# EasyEDA schematic SCH_Imposter-Game_2026-03-29.json
TITLE: Sheet_1; REV: 1.0; Date: 2026-01-31; Sheet: 1/1; Drawn By: shaur1021; Company: Your Company
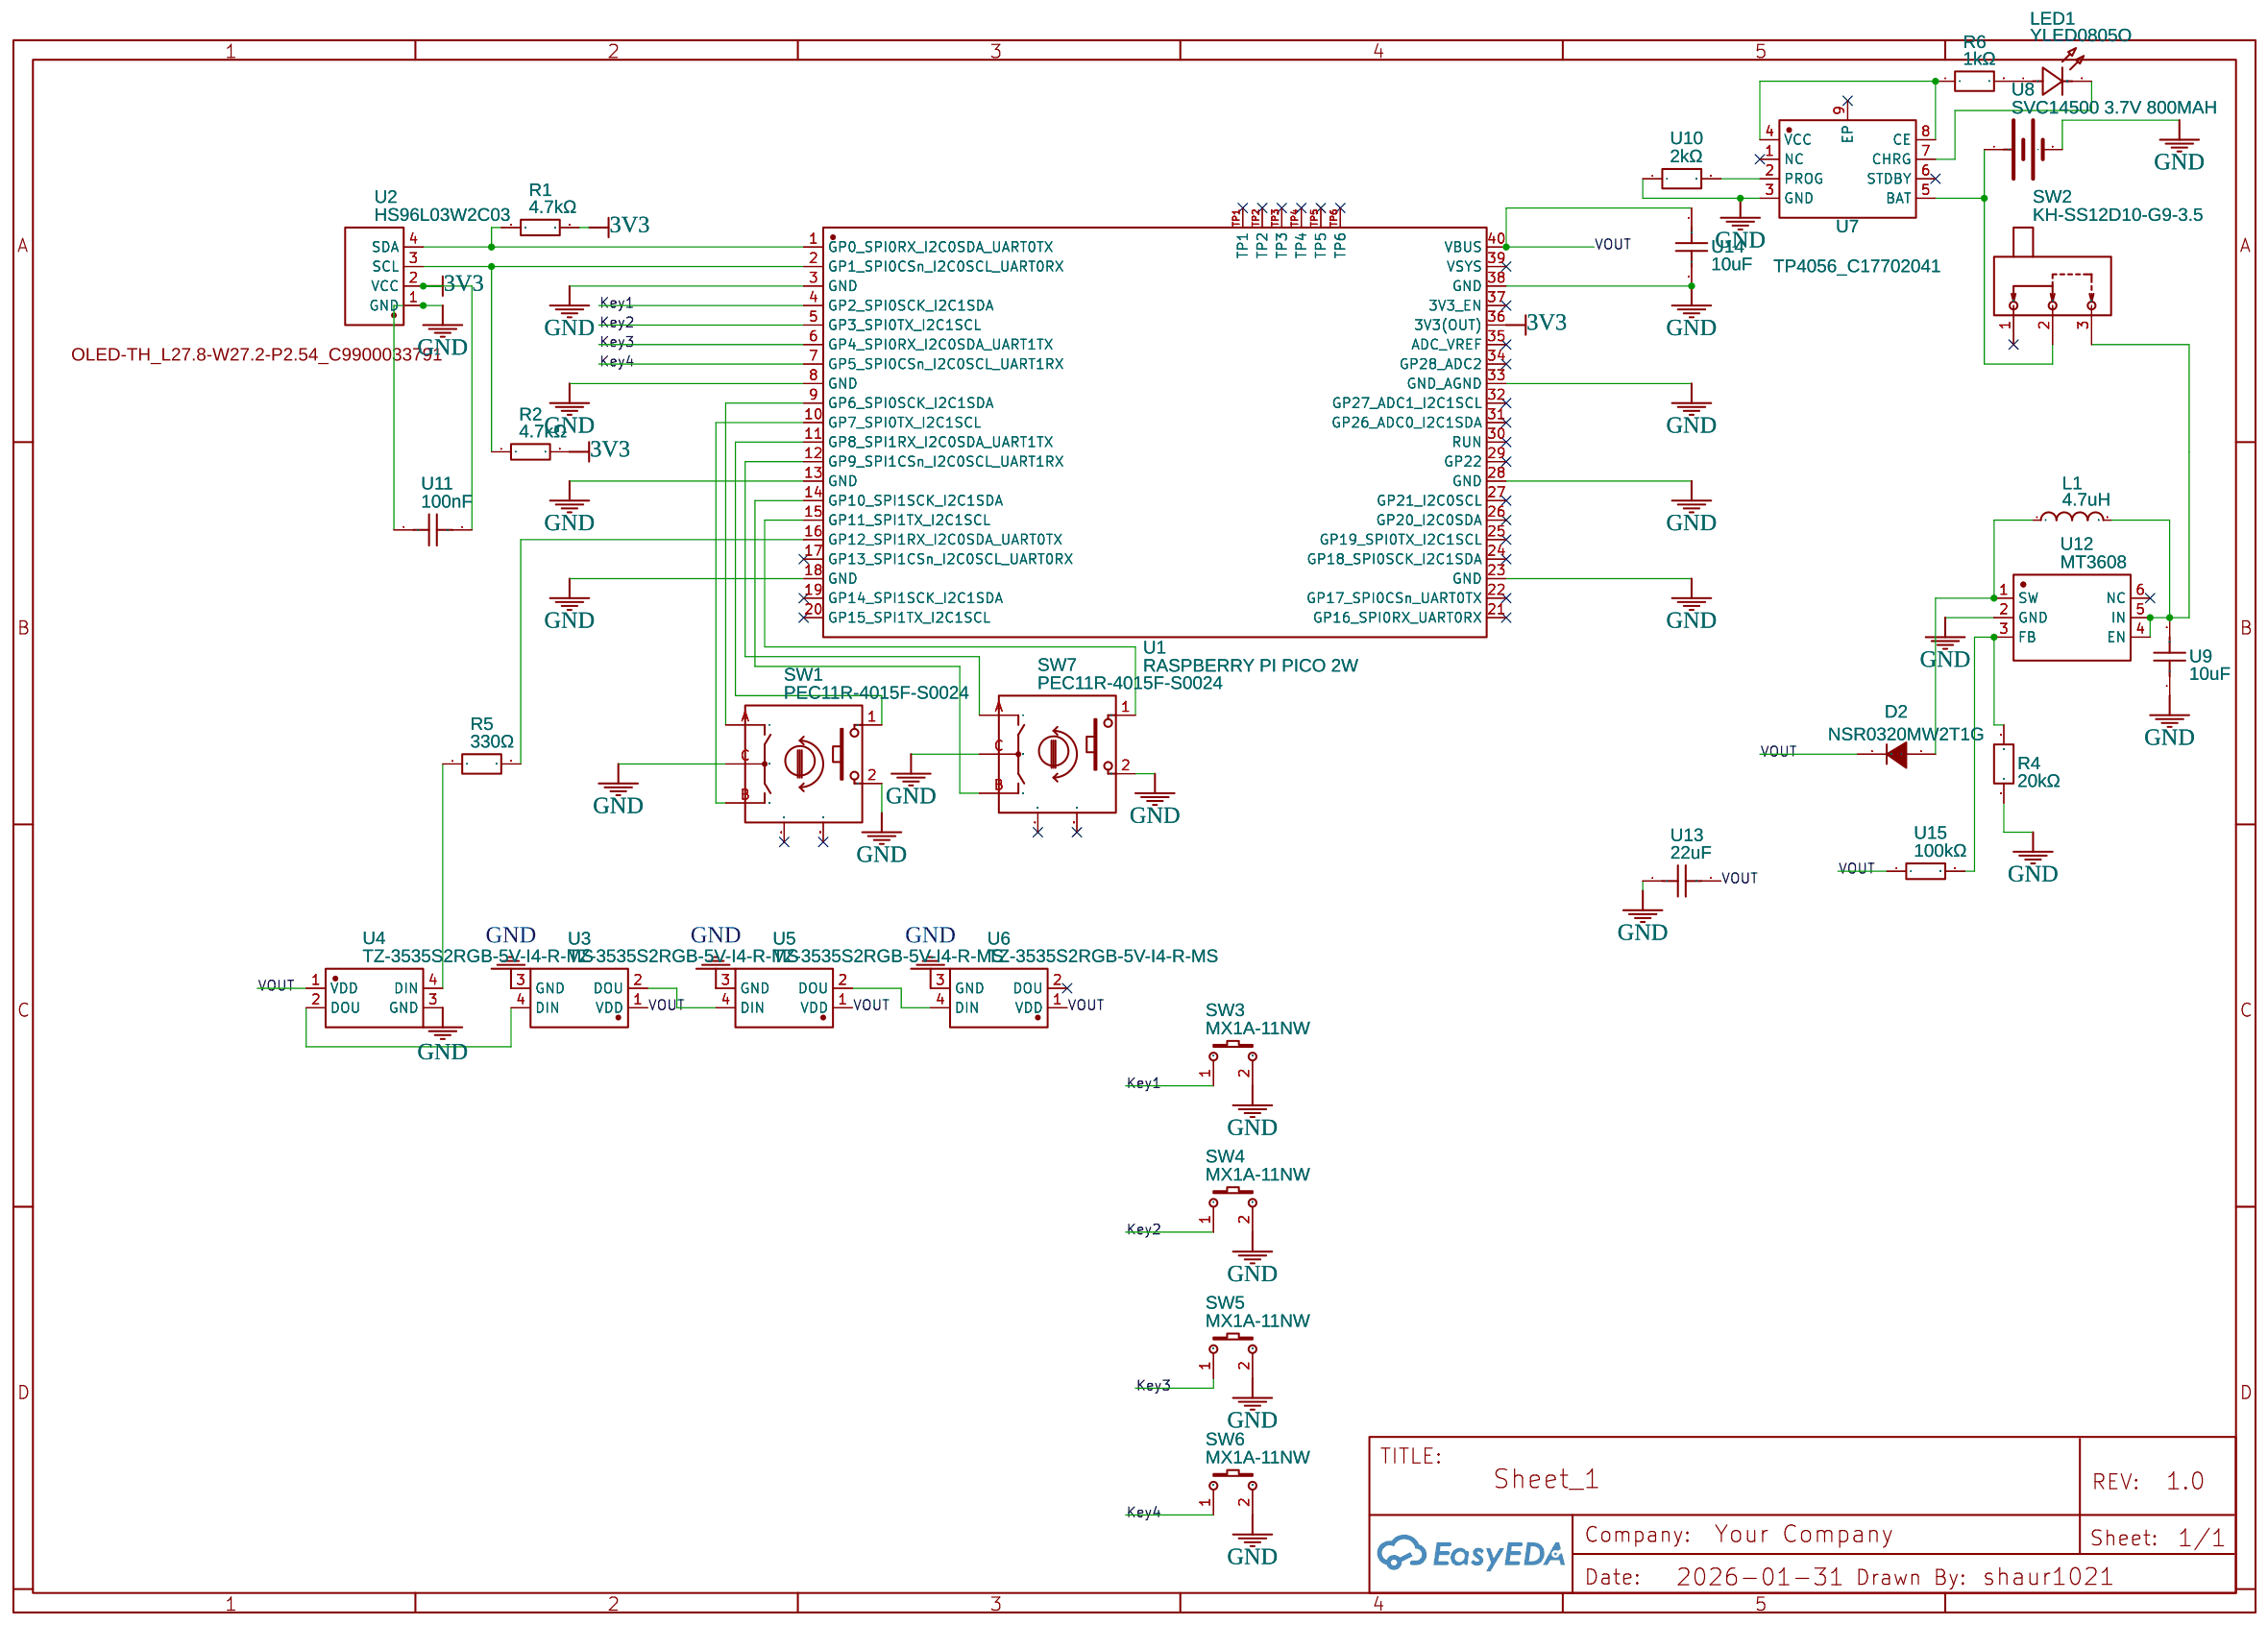
[diagram p0: schematic sheet]

## Parts
D2  NSR0320MW2T1G  [SOD-323_L1.8-W1.3-LS2.5-RD]
L1  4.7uH  [IND-SMD_L3.5-W3.0]
LED1  YLED0805O  [LED0805-FD-GREEN]
R1  4.7kΩ  [R0201]
R2  4.7kΩ  [R0201]
R4  20kΩ  [R1206]
R5  330Ω  [R0805]
R6  1kΩ  [R0603]
SW1  PEC11R-4015F-S0024  [SW-TH_PEC11R-4XXXF-SXXXX]
SW2  KH-SS12D10-G9-3.5  [SW-TH_KH-SS12D10-G9-3.5]
SW3  MX1A-11NW  [SW-TH_MX1A-11NW]
SW4  MX1A-11NW  [SW-TH_MX1A-11NW]
SW5  MX1A-11NW  [SW-TH_MX1A-11NW]
SW6  MX1A-11NW  [SW-TH_MX1A-11NW]
SW7  PEC11R-4015F-S0024  [SW-TH_PEC11R-4XXXF-SXXXX]
U1  RASPBERRY PI PICO 2W  [COMM-SMD_L51.0-W21.0-P2.54_PICOW]
U2  HS96L03W2C03  [OLED-TH_L27.8-W27.2-P2.54_C9900033791]
U3  TZ-3535S2RGB-5V-I4-R-MS  [LED-SMD_4P-L3.7-W3.5_E6Z3535RGBC4-D04HA-1.00H-RGB04]
U4  TZ-3535S2RGB-5V-I4-R-MS  [LED-SMD_4P-L3.7-W3.5_E6Z3535RGBC4-D04HA-1.00H-RGB04]
U5  TZ-3535S2RGB-5V-I4-R-MS  [LED-SMD_4P-L3.7-W3.5_E6Z3535RGBC4-D04HA-1.00H-RGB04]
U6  TZ-3535S2RGB-5V-I4-R-MS  [LED-SMD_4P-L3.7-W3.5_E6Z3535RGBC4-D04HA-1.00H-RGB04]
U7  TP4056_C17702041  [ESOP-8_L4.9-W3.9-P1.27-LS6.0-BL-EP-1]
U8  SVC14500 3.7V 800MAH  [BAT-TH_SVC14500-3.7V-800MAH]
U9  10uF  [C1812]
U10  2kΩ  [R0402]
U11  100nF  [C0402]
U12  MT3608  [SOT-23-6_L2.9-W1.6-P0.95-LS2.8-BL]
U13  22uF  [C1210]
U14  10uF  [C1812]
U15  100kΩ  [R0805]

## Library data of the parts
D2 = NSR0320MW2T1G: Supplier: LCSC; Manufacturer: onsemi(安森美); Supplier Part: C48192; JLCPCB Part Class: Extended Part
L1 = CD32N-4R7M: Contributor: lcsc; Supplier: LCSC; Supplier Part: C2875683; Manufacturer: MINGSTAR(登壹); JLCPCB Part Class: Extended Part
LED1 = YLED0805O: Supplier: LCSC; Supplier Part: C25170727; Manufacturer: YONGYUTAI(永裕泰); JLCPCB Part Class: Extended Part; Contributor: lcsc
R1 R2 = CR254701F: Contributor: lcsc; Supplier: LCSC; Supplier Part: C4155953; Manufacturer: Meritek; JLCPCB Part Class: Extended Part
R4 = FRC1206F2002TS: Supplier: LCSC; Supplier Part: C2933636; Manufacturer: FOJAN(富捷); JLCPCB Part Class: Extended Part; Contributor: lcsc
R5 = CRCW0805330RJNEA: Supplier: LCSC; Supplier Part: C844209; Manufacturer: VISHAY(威世); JLCPCB Part Class: Extended Part; Contributor: lcsc
R6 = APC0603B1K00N: Supplier: LCSC; Supplier Part: C7077186; Manufacturer: Ohmite; Contributor: lcsc; JLCPCB Part Class: Extended Part
SW1 SW7 = PEC11R-4015F-S0024: Contributor: LCSC; Supplier: LCSC; Supplier Part: C143789; Manufacturer: BOURNS; JLCPCB Part Class: Extended Part
SW2 = KH-SS12D10-G9-3.5: Contributor: lcsc; Supplier: LCSC; Supplier Part: C5274458; Manufacturer: kinghelm(金航标); JLCPCB Part Class: Extended Part
SW3-SW6 = MX1A-11NW: Supplier: LCSC; Supplier Part: C3316924; Manufacturer: CHERRY; Contributor: lcsc; JLCPCB Part Class: Extended Part
U1 = RASPBERRY PI PICO 2W: Supplier: LCSC; Supplier Part: C42394205; Manufacturer: Raspberry Pi(树莓派); Manufacturer Part: Raspberry Pi Pico 2W; Contributor: lcsc; JLCPCB Part Class: Extended Part
U2 = HS96L03W2C03: Contributor: lcsc; Supplier: LCSC; Supplier Part: C5248080; Manufacturer: HS(汉昇); JLCPCB Part Class: Extended Part; Package Display: Yes
U3-U6 = TZ-3535S2RGB-5V-I4-R-MS: Supplier: LCSC; Supplier Part: C26159670; Manufacturer: TUOZHAN(拓展光电); Contributor: lcsc; JLCPCB Part Class: Extended Part
U7 = TP4056_C17702041: Supplier: LCSC; Supplier Part: C17702041; Manufacturer: HXY MOSFET(华轩阳电子); Manufacturer Part: TP4056; Contributor: lcsc; JLCPCB Part Class: Extended Part
U8 = SVC14500 3.7V 800MAH: Supplier: LCSC; Supplier Part: C42404724; Manufacturer: Sharvin Power(经钛电子); Manufacturer Part: SVC14500 3.7V 800mAh; Contributor: lcsc
U9 U14 = C4532X7R1C106M230KA: Contributor: lcsc; Supplier: LCSC; Supplier Part: C3851081; Manufacturer: TDK
U10 = TNPW04022K00BYEP: Supplier: LCSC; Supplier Part: C3913181; Manufacturer: VISHAY(威世); Contributor: lcsc; JLCPCB Part Class: Extended Part
U11 = C1005X5R1A104K050BA: Contributor: lcsc; Supplier: LCSC; Supplier Part: C3870975; Manufacturer: TDK; JLCPCB Part Class: Extended Part
U12 = MT3608: Supplier: LCSC; Manufacturer: 西安航天民芯; Supplier Part: C84817; JLCPCB Part Class: Extended Part
U13 = MCAST32MSB7226KPNA01: Supplier: LCSC; Supplier Part: C5372271; Manufacturer: TAIYO YUDEN(太诱); JLCPCB Part Class: Extended Part; Contributor: lcsc
U15 = CHR0805H-100KJ8: Contributor: lcsc; Supplier: LCSC; Supplier Part: C4224854; Manufacturer: Riedon; JLCPCB Part Class: Extended Part

## Nets
3V3: R1.2 R2.2 U1.36(3V3(OUT)) U2.2(VCC) U11.2
GND: R4.1 SW1.2 SW1.C SW3.2 SW4.2 SW5.2 SW6.2 SW7.2 SW7.C U1.3(GND) U1.8(GND) U1.13(GND) U1.18(GND) U1.23(GND) U1.28(GND) U1.33(GND_AGND) U1.38(GND) U2.1(GND) U3.3(GND) U4.3(GND) U5.3(GND) U6.3(GND) U7.3(GND) U8.2(-) U9.1 U10.1 U11.1 U12.2(GND) U13.1 U14.2
Key1: SW3.1 U1.4(GP2_SPI0SCK_I2C1SDA)
Key2: SW4.1 U1.5(GP3_SPI0TX_I2C1SCL)
Key3: SW5.1 U1.6(GP4_SPI0RX_I2C0SDA_UART1TX)
Key4: SW6.1 U1.7(GP5_SPI0CSn_I2C0SCL_UART1RX)
VOUT: D2.1(C) U1.40(VBUS) U3.1(VDD) U4.1(VDD) U5.1(VDD) U6.1(VDD) U13.2 U14.1 U15.1
Net-(D2-2): D2.2(A) L1.1 U12.1(SW)
Net-(L1-2): L1.2 SW2.3 U9.2 U12.4(EN) U12.5(IN)
Net-(LED1-1): LED1.1(A) R6.2
Net-(LED1-2): LED1.2(C) U7.7(CHRG)
Net-(R1-1): R1.1 U1.1(GP0_SPI0RX_I2C0SDA_UART0TX) U2.4(SDA)
Net-(R2-1): R2.1 U1.2(GP1_SPI0CSn_I2C0SCL_UART0RX) U2.3(SCL)
Net-(R4-2): R4.2 U12.3(FB) U15.2
Net-(R5-1): R5.1 U4.4(DIN)
Net-(R5-2): R5.2 U1.16(GP12_SPI1RX_I2C0SDA_UART0TX)
Net-(R6-1): R6.1 U7.4(VCC) U7.8(CE)
Net-(SW1-1): SW1.1 U1.11(GP8_SPI1RX_I2C0SDA_UART1TX)
Net-(SW1-A): SW1.A U1.9(GP6_SPI0SCK_I2C1SDA)
Net-(SW1-B): SW1.B U1.10(GP7_SPI0TX_I2C1SCL)
Net-(SW2-2): SW2.2 U7.5(BAT) U8.1(+)
Net-(SW7-1): SW7.1 U1.15(GP11_SPI1TX_I2C1SCL)
Net-(SW7-A): SW7.A U1.12(GP9_SPI1CSn_I2C0SCL_UART1RX)
Net-(SW7-B): SW7.B U1.14(GP10_SPI1SCK_I2C1SDA)
Net-(U3-2): U3.2(DOU) U5.4(DIN)
Net-(U3-4): U3.4(DIN) U4.2(DOU)
Net-(U5-2): U5.2(DOU) U6.4(DIN)
Net-(U7-2): U7.2(PROG) U10.2

Not connected (* = marked no-connect by the designer): SW1 MT1* MT2*; SW2 1*; SW7 MT1* MT2*; U1 17(GP13_SPI1CSn_I2C0SCL_UART0RX)* 19(GP14_SPI1SCK_I2C1SDA)* 20(GP15_SPI1TX_I2C1SCL)* 21(GP16_SPI0RX_UART0RX)* 22(GP17_SPI0CSn_UART0TX)* 24(GP18_SPI0SCK_I2C1SDA)* 25(GP19_SPI0TX_I2C1SCL)* 26(GP20_I2C0SDA)* 27(GP21_I2C0SCL)* 29(GP22)* 30(RUN)* 31(GP26_ADC0_I2C1SDA)* 32(GP27_ADC1_I2C1SCL)* 34(GP28_ADC2)* 35(ADC_VREF)* 37(3V3_EN)* 39(VSYS)* TP1* TP2* TP3* TP4* TP5* TP6*; U6 2(DOU)*; U7 1(NC)* 6(STDBY)* 9(EP)*; U12 6(NC)*
